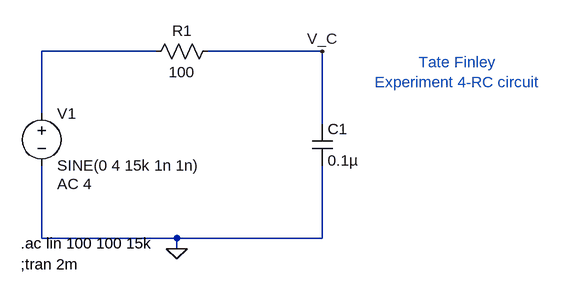
[diagram p0: schematic ECE3060_Exp4_RC.asc]
ECE3060_Exp4_RC.asc, the LTspice schematic file:
Version 4
SHEET 1 880 680
WIRE 80 32 -96 32
WIRE 336 32 160 32
WIRE -96 128 -96 32
WIRE 336 144 336 32
WIRE -96 320 -96 208
WIRE 112 320 -96 320
WIRE 336 320 336 208
WIRE 336 320 112 320
WIRE 112 336 112 320
FLAG 112 336 0
FLAG 336 32 V_C
SYMBOL voltage -96 112 R0
WINDOW 123 24 124 Left 2
WINDOW 39 0 0 Left 0
SYMATTR Value2 AC 4
SYMATTR InstName V1
SYMATTR Value SINE(0 4 15k 1n 1n)
SYMBOL res 176 16 R90
WINDOW 0 0 56 VBottom 2
WINDOW 3 32 56 VTop 2
SYMATTR InstName R1
SYMATTR Value 100
SYMBOL cap 320 144 R0
SYMATTR InstName C1
SYMATTR Value 0.1µ
TEXT -128 328 Left 2 !.ac lin 100 100 15k
TEXT 544 64 Center 2 ;Tate Finley\nExperiment 4-RC circuit
TEXT -128 360 Left 2 !;tran 2m

The netlist it stands for:
* ECE3060_Exp4_RC.asc
V1 N001 0 SINE(0 4 15k 1n 1n) AC 4
R1 V_C N001 100
C1 V_C 0 0.1µ
.ac lin 100 100 15k
* Tate Finley
* Experiment 4-RC circuit
;tran 2m
.backanno
.end